# Altium schematic sheet Sheet1.SchDoc
size A3
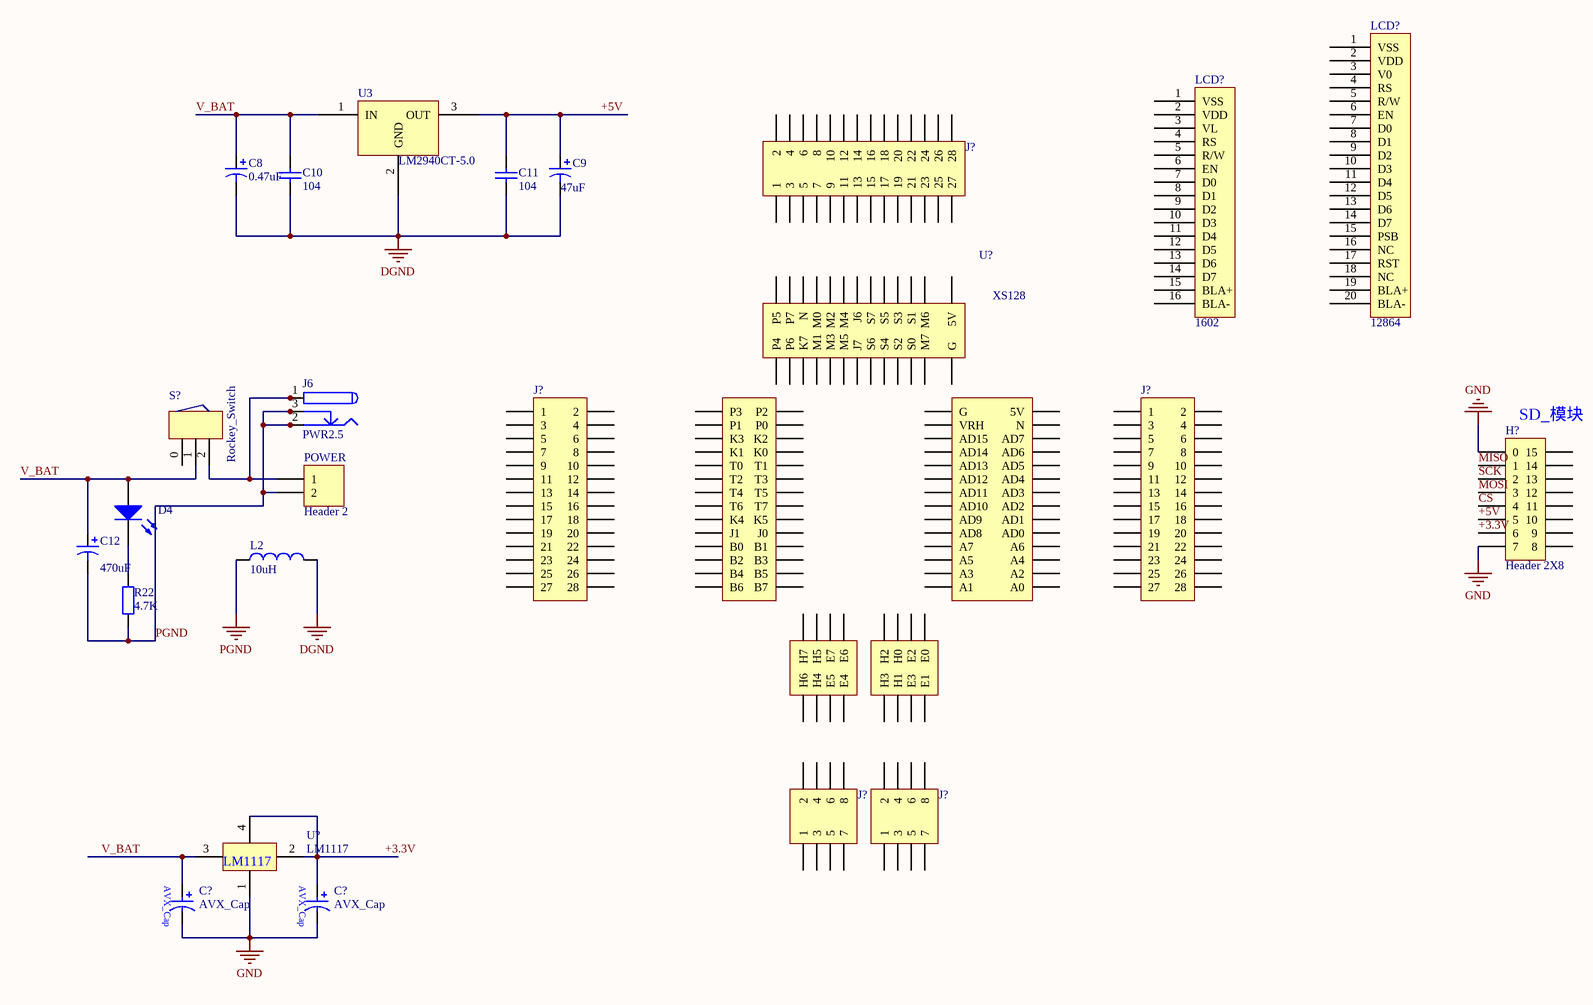
[diagram p0: Sheet1.SchDoc]

## Parts
(Parts that share a designator on the sheet are numbered #1, #2 ... from top to bottom, then left to right.)
C8  value 0.47uF  [B]  (hidden comment: Cap Pol3)
C9  value 47uF  [47uf/25V]  (hidden comment: Cap Pol3)
C10  value 104  [6-0805]  (hidden comment: Cap)
C11  value 104  [6-0805]  (hidden comment: Cap)
C12  value 470uF  [470uF/25V]  (hidden comment: Cap Pol1)
C?#1  AVX_Cap  [AVX_Cap_10uF]
C?#2  AVX_Cap  [AVX_Cap_10uF]
D4  LED1  [3.2X1.6X1.1]  (value not drawn)
H?  Header 2X8  [HDR2X8]
J6  PWR2.5  [KLD-0202]
J?#1  Header 14X2  [HDR2X14]  (value not drawn)
J?#2  Header 14X2  [HDR2X14]  (value not drawn)
J?#3  Header 14X2  [HDR2X14]  (value not drawn)
J?#4  Header 4X2  [HDR2X4]  (value not drawn)
J?#5  Header 4X2  [HDR2X4]  (value not drawn)
L2  value 10uH  [0402-A]  (hidden comment: Inductor)
LCD?#1  12864  [HDR!X20]
LCD?#2  1602  [HDR1X16]
POWER  Header 2  [HDR1X2]
R22  value 4.7K  [2012[0805]]  (hidden comment: Res2)
S?  Rockey_Switch  [Rockey_Switch]
U3  LM2940CT-5.0  [LM2940]
U?#1  XS128  [XS128接口]
U?#2  LM1117  [SOT230LM1117]

## Nets
DGND: C8.2 C9.2 C10.2 C11.2 L2.2 U3.2(GND)
GND: C?#1.2(-) C?#2.2(-) H?.0 H?.7 U?#2.1(GND)
PGND: C12.2 J6.2 J6.2A J6.2B J6.3 J6.3A J6.3B L2.1 POWER.2 R22.1
+3.3V: C?#2.1(+) H?.6 U?#2.2(OUT) U?#2.4(TAB)
+5V: C9.1 C11.1 H?.5 U3.3(OUT)
CS: H?.4
MISO: H?.1
MOSI: H?.3
SCK: H?.2
V_BAT: C8.1 C10.1 C12.1 C?#1.1(+) D4.1(A) S?.1(B) U3.1(IN) U?#2.3(IN)
NetD4_2: D4.2(K) R22.2
NetJ6_1: J6.1 J6.1A J6.1B POWER.1 S?.2(C)

Not connected (* = marked no-connect by the designer): H? 8 9 10 11 12 13 14 15; J?#1 1 2 3 4 5 6 7 8 9 10 11 12 13 14 15 16 17 18 19 20 21 22 23 24 25 26 27 28; J?#2 1 2 3 4 5 6 7 8 9 10 11 12 13 14 15 16 17 18 19 20 21 22 23 24 25 26 27 28; J?#3 1 2 3 4 5 6 7 8 9 10 11 12 13 14 15 16 17 18 19 20 21 22 23 24 25 26 27 28; J?#4 1 2 3 4 5 6 7 8; J?#5 1 2 3 4 5 6 7 8; LCD?#1 1(VSS) 2(VDD) 3(V0) 4(RS) 5(R/W) 6(EN) 7(D0) 8(D1) 9(D2) 10(D3) 11(D4) 12(D5) 13(D6) 14(D7) 15(PSB) 16(NC) 17(RST) 18(NC) 19(BLA+) 20(BLA-); LCD?#2 1(VSS) 2(VDD) 3(VL) 4(RS) 5(R/W) 6(EN) 7(D0) 8(D1) 9(D2) 10(D3) 11(D4) 12(D5) 13(D6) 14(D7) 15(BLA+) 16(BLA-); S? 0(A); U?#1 101(P3) 102(P2) 103(P1) 104(P0) 105(K3) 106(K2) 107(K1) 108(K0) 109(T0) 110(T1) 111(T2) 112(T3) 113(T4) 114(T5) 115(T6) 116(T7) 117(K4) 118(K5) 119(J1) 120(J0) 121(B0) 122(B1) 123(B2) 124(B3) 125(B4) 126(B5) 127(B6) 128(B7) 201(5V) 202(G) 205(M6) 206(M7) 207(S1) 208(S0) 209(S3) 210(S2) 211(S5) 212(S4) 213(S7) 214(S6) 215(J6) 216(J7) 217(M4) 218(M5) 219(M2) 220(M3) 221(M0) 222(M1) 223(N) 224(K7) 225(P7) 226(P6) 227(P5) 228(P4) 301(A0) 302(A1) 303(A2) 304(A3) 305(A4) 306(A5) 307(A6) 308(A7) 309(AD0) 310(AD8) 311(AD1) 312(AD9) 313(AD2) 314(AD10) 315(AD3) 316(AD11) 317(AD4) 318(AD12) 319(AD5) 320(AD13) 321(AD6) 322(AD14) 323(AD7) 324(AD15) 325(N) 326(VRH) 327(5V) 328(G) 401(H6) 402(H7) 403(H4) 404(H5) 405(E5) 406(E7) 407(E4) 408(E6) 501(H3) 502(H2) 503(H1) 504(H0) 505(E3) 506(E2) 507(E1) 508(E0)

## Notes on the sheet
- (near H?) SD_模块

## Library data of the parts
C8 C9 = Cap: Polarized Capacitor (Surface Mount); Published: 8-Jun-2000; LatestRevisionDate: 17-Jul-2002; LatestRevisionNote: Re-released for DXP Platform.; PackageReference: C0805; Publisher: Altium Limited
C10 C11 = Cap: Capacitor; Published: 8-Jun-2000; LatestRevisionDate: 17-Jul-2002; LatestRevisionNote: Re-released for DXP Platform.; PackageReference: RAD-0.3; Publisher: Altium Limited
C12 = Cap Pol1: Polarized Capacitor (Radial); Published: 8-Jun-2000; LatestRevisionDate: 17-Jul-2002; LatestRevisionNote: Re-released for DXP Platform.; PackageReference: RB7.6-15; Publisher: Altium Limited
D4 = LED1: Typical RED GaAs LED; Published: 8-Jun-2000; LatestRevisionDate: 08-Jul-2005; LatestRevisionNote: Mech Layer 1 removed.; PackageReference: LED-1; Publisher: Altium Limited
J6 = PWR2.5: Low Voltage Power Supply Connector; Published: 17-Dec-2003; DatasheetDocument: 09-May-2002; Publisher: Altium Limited; ComponentLink1Description: Manufacturer Link; ComponentLink1URL: http://domino.kycon.com/internet/Products.html
J?#1-J?#3 = Header 14X2: Header, 14-Pin, Dual row; LatestRevisionDate: 17-Jul-2002; LatestRevisionNote: Re-released for DXP Platform.; Publisher: Altium Limited
J?#4 J?#5 = Header 4X2: Header, 4-Pin, Dual row; LatestRevisionDate: 17-Jul-2002; LatestRevisionNote: Re-released for DXP Platform.; Publisher: Altium Limited
L2 = Indu: Code_IEC: 1005; Published: 8-Jun-2000; LatestRevisionDate: 17-Jul-2002; LatestRevisionNote: Re-released for DXP Platform.; PackageReference: 0402-A; Publisher: Altium Limited; Code_JEITA: 0402
POWER = Header 2: Header, 2-Pin; LatestRevisionDate: 17-Jul-2002; LatestRevisionNote: Re-released for DXP Platform.; Publisher: Altium Limited
R22 = Res2: Resistor; Published: 8-Jun-2000; LatestRevisionDate: 17-Jul-2002; LatestRevisionNote: Re-released for DXP Platform.; PackageReference: AXIAL-0.4; Publisher: Altium Limited
U3 = LM2940CT